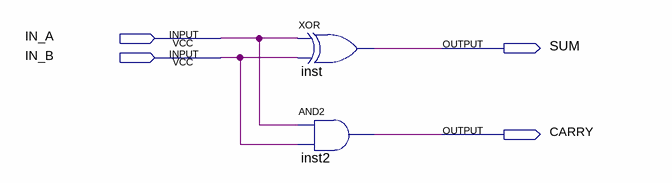
[diagram p0: schematic sheet]
// Quartus schematic HALF_ADDER.bdf as structural Verilog: 2 symbols, 4 pins
module HALF_ADDER (
  input  IN_A,
  input  IN_B,
  output SUM,
  output CARRY
);

  xor inst (SUM, IN_A, IN_B);
  and inst2 (CARRY, IN_A, IN_B);
endmodule
